# EAGLE design USB Snoop (EAGLE 6.5.0)
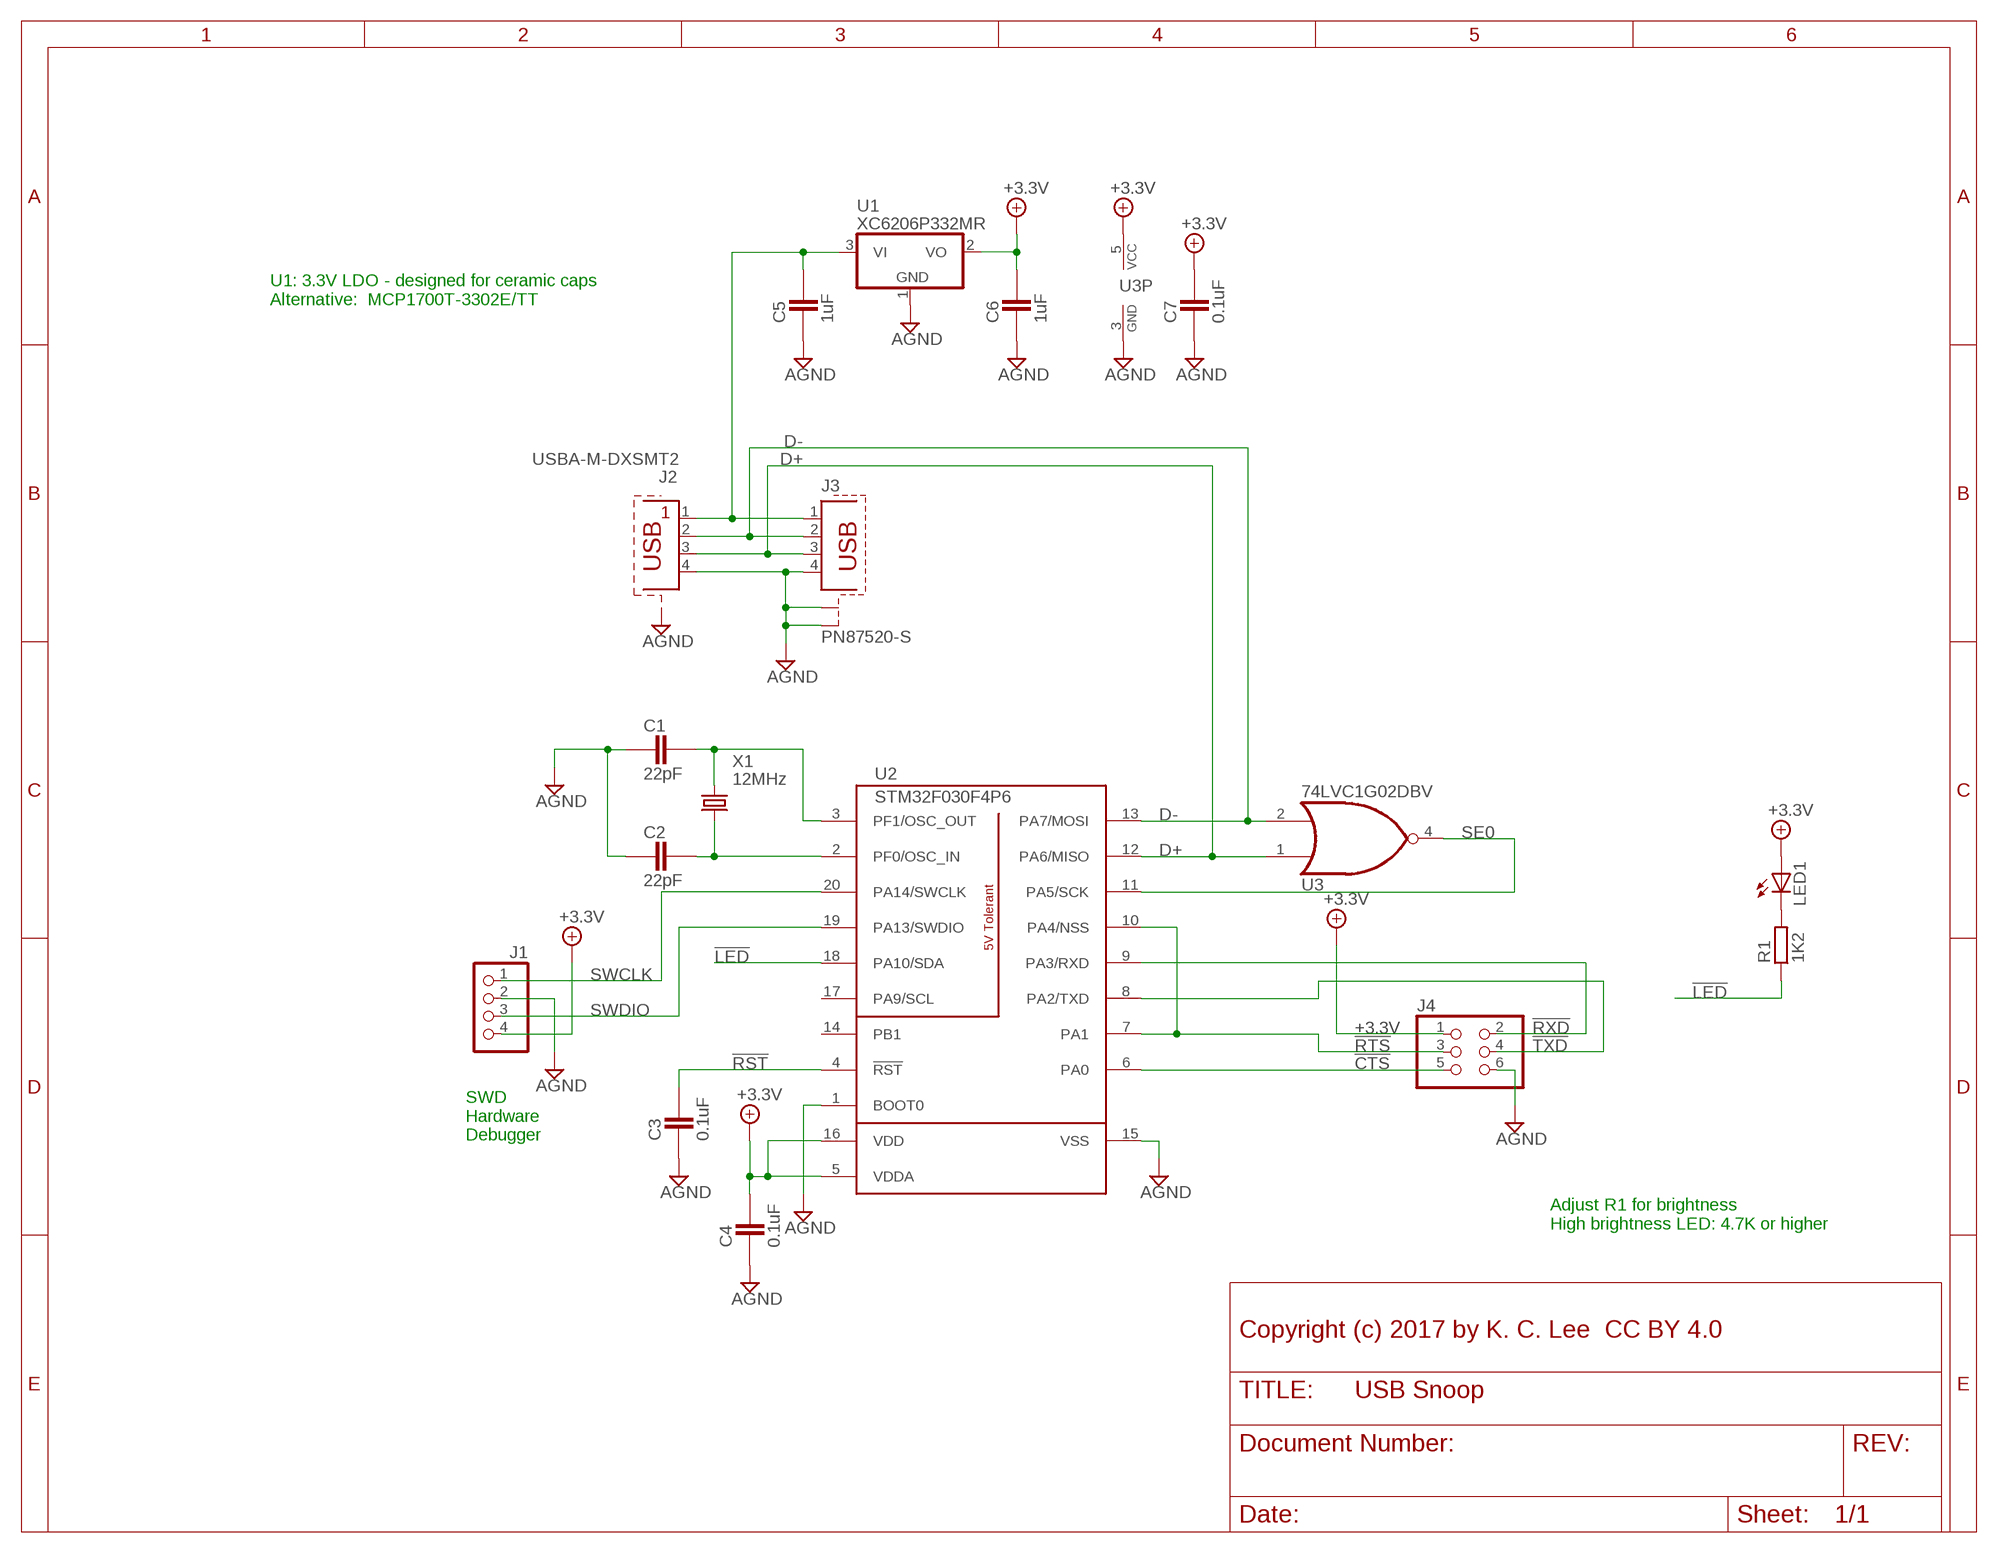
[diagram p0: schematic, sheet 1]

## Parts
C1  22pF  CAPACITOR_0603  [CAPC1608X92N]
C2  22pF  CAPACITOR_0603  [CAPC1608X92N]
C3  0.1uF  CAPACITOR_0603  [CAPC1608X92N]
C4  0.1uF  CAPACITOR_0603  [CAPC1608X92N]
C5  1uF  CAPACITOR_0603  [CAPC1608X92N]
C6  1uF  CAPACITOR_0603  [CAPC1608X92N]
C7  0.1uF  CAPACITOR_0603  [CAPC1608X92N]
J1  PINHD-1X4_2.54  [1X04]
J2  USBA-M-DXSMT2  [CHINESE_USB_M_SMT-2]
J3  PN87520-S  [PN87520-S]
J4  PINHD-2X3_2.00  [2X03M_TH]
LED1  LEDSML0603  [SML0603]
R1  1K2  RESISTOR_0603  [RESC1608X55N]
U1  XC6206P332MR  MCP1700/TT  [SOT95P280X135-3N]
U2  STM32F030F4P6  [TSSOP20]
U3  74LVC1G02DBV  [SOT23-5]
X1  12MHz  CRYSTALTC26H  [TC26H]

## Nets
!CTS: J4.5 U2.6(PA0)
!LED: R1.1 U2.18(PA10/SDA)
!RST: C3.2 U2.4(!RST)
!RTS: J4.3 U2.7(PA1) U2.10(PA4/NSS)
!RXD: J4.2 U2.9(PA3/RXD)
!TXD: J4.4 U2.8(PA2/TXD)
+3.3V: C4.2 C6.2 C7.2 J1.4 J4.1 LED1.A U1.2(VO) U2.5(VDDA) U2.16(VDD) U3.5(VCC)
AGND: C1.1 C2.1 C3.1 C4.1 C5.1 C6.1 C7.1 J1.2 J2.4 J2.S1 J2.S2(S1) J3.4 J3.S1 J3.S2 J4.6 U1.1(GND) U2.1(BOOT0) U2.15(VSS) U3.3(GND)
D+: J2.3 J3.3 U2.12(PA6/MISO) U3.1(I0)
D-: J2.2 J3.2 U2.13(PA7/MOSI) U3.2(I1)
N$1: C2.2 U2.2(PF0/OSC_IN) X1.2
N$2: LED1.C R1.2
N$41: C1.2 U2.3(PF1/OSC_OUT) X1.1
SE0: U2.11(PA5/SCK) U3.4(O)
SWCLK: J1.1 U2.20(PA14/SWCLK)
SWDIO: J1.3 U2.19(PA13/SWDIO)
VUSB: C5.2 J2.1 J3.1 U1.3(VI)
Unconnected: U2.14(PB1) U2.17(PA9/SCL)

## Notes on the sheet
- U1: 3.3V LDO - designed for ceramic caps
  Alternative:  MCP1700T-3302E/TT
- SWD 
  Hardware
  Debugger
- Adjust R1 for brightness
  High brightness LED: 4.7K or higher
- Copyright (c) 2017 by K. C. Lee  CC BY 4.0

## Library data of the parts
C1-C4 C7 = ipc-7351-capacitor:CAPACITOR_; PARTNO: *
C5 C6 = ipc-7351-capacitor:CAPACITOR_; PARTNO: STOCK: 1UF/10V 20% TDK
J1 = Misc Conn:PINHD-1X4: PIN HEADER; PARTNO: 1X04 HEADER 2.54MM
J2 = Misc Conn:USBA-M-DX: DX USB A Male PCB mounted connectors; PARTNO: *
J3 = con-berg:PN87520-S; OC_FARNELL: unknown; OC_NEWARK: unknown; PARTNO: *
J4 = Misc Conn:PINHD-2X3: PIN HEADER; PARTNO: *
LED1 = led:LED: LED OSRAM: - CHIPLED LG R971, LG N971, LY N971, LG Q971, LY Q971, LO R971, LY R971 LH N974, LH R974 LS Q976, LO Q976, LY Q976 LO Q996 - Hyper CHIPLED LW Q18S LB Q993, LB Q99A, LB R99A - SideLED LS A670, LO A670, LY A670, LG A670, LP A670 LB A673, LV A673, LT A673, LW A673 LH A674 LY A675 LS A676, LA A676, LO A676, LY A676, LW A676 LS A679, LY A679, LG A679 - Hyper Micro SIDELED® LS Y876, LA Y876, LO Y876, LY Y876 LT Y87S - SmartLED LW L88C, LW L88S LB L89C, LB L89S, LG L890 LS L89K, LO L89K, LY L89K LS L896, LA L896, LO L896, LY L896 - TOPLED LS T670, LO T670, LY T670, LG T670, LP T670 LSG T670, LSP T670, LSY T670, LOP T670, LYG T670 LG T671, LOG T671, LSG T671 LB T673, LV T673, LT T673, LW T673 LH T674 LS T676, LA T676, LO T676, LY T676, LB T676, LH T676, LSB T676, LW T676 LB T67C, LV T67C, LT T67C, LS T67K, LO T67K, LY T67K, LW E67C LS E67B, LA E67B, LO E67B, LY E67B, LB E67C, LV E67C, LT E67C LW T67C LS T679, LY T679, LG T679 LS T770, LO T770, LY T770, LG T770, LP T770 LB T773, LV T773, LT T773, LW T773 LH T774 LS E675, LA E675, LY E675, LS T675 LS T776, LA T776, LO T776, LY T776, LB T776 LHGB T686 LT T68C, LB T68C - Hyper Mini TOPLED® LB M676 - Mini TOPLED Santana® LG M470 LS M47K, LO M47K, LY M47K Source: http://www.osram.convergy.de LUXEON: - LUMILED® LXK2-PW12-R00, LXK2-PW12-S00, LXK2-PW14-U00, LXK2-PW14-V00 LXK2-PM12-R00, LXK2-PM12-S00, LXK2-PM14-U00 LXK2-PE12-Q00, LXK2-PE12-R00, LXK2-PE12-S00, LXK2-PE14-T00, LXK2-PE14-U00 LXK2-PB12-K00, LXK2-PB12-L00, LXK2-PB12-M00, LXK2-PB14-N00, LXK2-PB14-P00, LXK2-PB14-Q00 LXK2-PR12-L00, LXK2-PR12-M00, LXK2-PR14-Q00, LXK2-PR14-R00 LXK2-PD12-Q00, LXK2-PD12-R00, LXK2-PD12-S00 LXK2-PH12-R00, LXK2-PH12-S00 LXK2-PL12-P00, LXK2-PL12-Q00, LXK2-PL12-R00 Source: www.luxeon.com KINGBRIGHT: KA-3528ASYC Source: www.kingbright.com; PARTNO: *
R1 = ipc-7351-resistor:RESISTOR_; PARTNO: *
U1 = Misc Power:MCP1700; PARTNO: *
U2 = Misc Processor:STM32F030F4P6; PARTNO: *
U3 = 74xx-little-us:74*1G02: 2-input NOR gate; PARTNO: *
X1 = crystal:CRYSTAL: CRYSTAL; OC_FARNELL: unknown; OC_NEWARK: unknown; PARTNO: *

## Net classes
1 diff: width 0.003 mm, drill 0.006 mm, clearance 0.007 mm

## Board
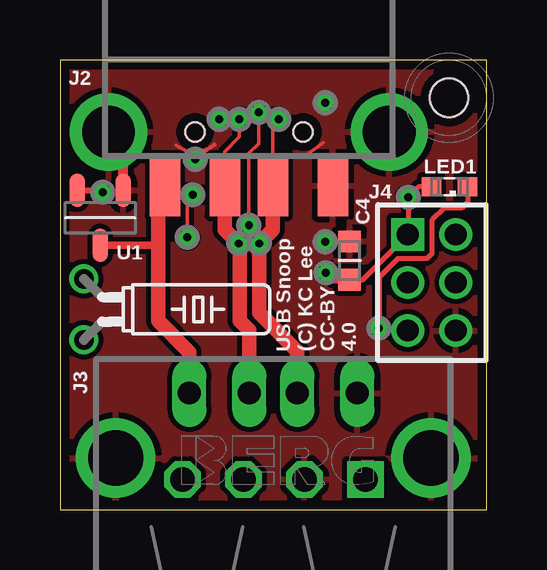
[diagram p1: board, top side]
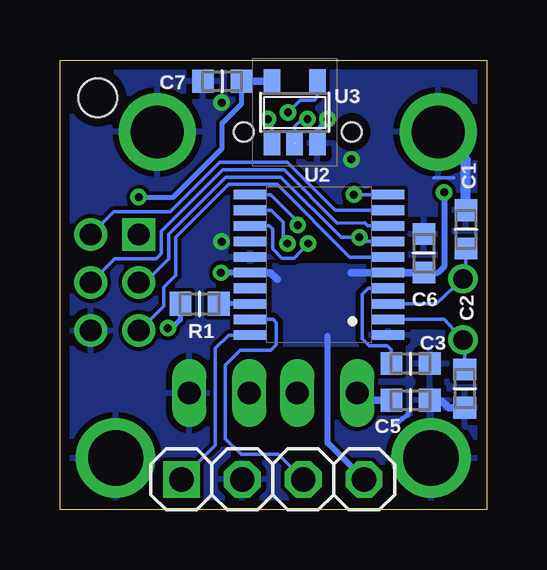
[diagram p2: board, bottom side, seen from below]

Size 17.78 x 18.75 mm. Coordinates in mm from the lower left corner, seen from the top.
Outline: 17.78,18.75 0,18.75 0,0 17.78,0 17.78,18.75
Copper layers (1*16): Top 0.0356mm / dielectric 1.5011mm / Bottom 0.0356mm
Design rules "oshpark-2layer-tented-vias": minimum track width 6mil, minimum drill 13mil, track to track 6mil, track to pad 6mil, pad to pad 6mil, via to via 6mil, smd to smd 6mil, copper to edge 15mil, drill to drill 6mil, minimum pad ring 7mil, minimum via ring 7mil, stop-mask expansion 4mil, vias tented up to drill 13mil, thermal gap 10mil
Holes 1.6 mm at 16.21,17.17
bRestrict: 1 lines

### Footprints (pad centres in the part's own frame; a part is rotated, then mirrored left to right if it is on the bottom)
CAPC1608X92N = smd 0.9 x 0.95: 1 -0.8,0; 2 0.8,0
1X04 = drill 1.016 square: 1 -3.81,0 | drill 1.016 octagon: 2 -1.27,0; 3 1.27,0; 4 3.81,0
CHINESE_USB_M_SMT-2 = smd 1.27 x 2.54: 1 3.5,2.242; 2 1,2.242; 3 -1,2.242; 4 -3.5,2.242 | drill 2.2 pad 2.794: S1 -5.85,0; S2 5.85,0 | hole 0.8: -2.25,0; 2.25,0
PN87520-S = drill 0.95 long: 1 -3.5,2.71; 2 -1,2.71; 3 1,2.71; 4 3.5,2.71 | drill 2.3 pad 2.9: S1 -6.57,0; S2 6.57,0
2X03M_TH = drill 0.914 square: 1 -2,-1 | drill 0.914: 2 -2,1; 3 0,-1; 4 0,1; 5 2,-1; 6 2,1
SML0603 = smd 0.8 x 0.8: A 0.75,0; C -0.75,0
RESC1608X55N = smd 0.9 x 1: 1 -0.8,0; 2 0.8,0
SOT95P280X135-3N = smd 1.4 x 0.65: 1 -1.15,0.95; 2 -1.15,-0.95; 3 1.15,0
TSSOP20 = smd 0.4 x 1.35: 1 -2.925,-2.875; 2 -2.275,-2.875; 3 -1.625,-2.875; 4 -0.975,-2.875; 5 -0.325,-2.875; 6 0.325,-2.875; 7 0.975,-2.875; 8 1.625,-2.875; 9 2.275,-2.875; 10 2.925,-2.875; 11 2.925,2.875; 12 2.275,2.875; 13 1.625,2.875; 14 0.975,2.875; 15 0.325,2.875; 16 -0.325,2.875; 17 -0.975,2.875; 18 -1.625,2.875; 19 -2.275,2.875; 20 -2.925,2.875
SOT23-5 = smd 0.69 x 0.99: 1 -0.95,-1.29; 2 0,-1.29; 3 0.95,-1.29; 4 0.95,1.3; 5 -0.95,1.3
TC26H = drill 0.813: 1 -1.27,0; 2 1.27,0

### Placement (x,y rotation side)
C1  0.86,11.68 270 bottom
C2  0.91,5.05 90 bottom
C3  3.17,6.1 180 bottom
C4  12.06,10.39 270 top
C5  3.17,4.57 180 bottom
C6  2.62,10.69 270 bottom
C7  11.02,17.86 0 bottom
J1  8.92,1.27 0 bottom
J2  7.87,15.75 180 top
J3  8.89,2.16 0 top
J4  15.49,9.47 270 top
LED1  16.23,13.46 180 top
R1  11.96,8.59 180 bottom
U1  1.68,12.17 270 top
U2  6.99,10.21 90 bottom
U3  8,16.56 0 bottom
X1  16MHz  [TC26H]  0.99,8.36 270 top

### Tracks (layer width: path | path; a pad name or v marks a point on that pad's centre or on a via)
!CTS
  Bottom 0.152: U2.6 5.71,10.54 8.74,13.56 10.74,13.56 12.95,11.35 12.95,9.78 13.46,9.27 13.46,8.48 J4.5
!LED
  Bottom 0.203: U2.18 R1.1
!RST
  Bottom 0.152: U2.4 4.94,9.24 5.18,8.99 5.18,7.14 4.9,6.83 4.14,6.83 3.98,6.67 C3.2
!RTS  (via drill 0.33)
  Top 0.152: v5.54,13.13 5.31,12.9 v5.31,11.35
  Bottom 0.152: U2.7 5.17,11.19 v5.31,11.35 6.07,11.35 8.59,13.87 10.87,13.87 13.26,11.48 13.26,10.46 14.25,9.47 J4.3 | U2.10 v5.53,13.14 v5.54,13.13
!RXD
  Bottom 0.152: U2.9 6.31,12.49 8.31,14.48 11.12,14.48 13.18,12.42 15.54,12.42 15.96,12.01 J4.2
!TXD
  Bottom 0.152: U2.8 4.95,11.84 5.08,11.96 6.22,11.94 8.43,14.17 11,14.17 13.56,11.61 13.56,10.67 13.77,10.46 15.49,10.46 J4.4
+3.3V  (via drill 0.33)
  Top 0.152: J4.1 14.5,11.48
  Top 0.203: J4.1 12.61,9.59 C4.2 | 14.5,11.48 v14.5,13.03 14.94,13.46 LED1.A
  Top 0.254: U1.2 1.68,13.32 v1.78,13.23
  Top 0.305: C4.2 11.37,9.59 v11.07,9.88
  Bottom 0.203: v14.5,13.03 13.06,13.03 11.02,15.06 11.02,16.1 10.22,16.9 C7.2
  Bottom 0.254: J1.4 6.63,2.79 6.63,7.24 | U2.16 10.97,9.89 v11.07,9.88 | C6.2 2.03,9.89 1.75,10.16 1.75,13.23 v1.78,13.23
  Bottom 0.305: U2.16 9.02,9.89 8.74,9.6 | 5.64,9.89 U2.5 C6.2 | C7.2 U3.5
  pour Bottom (isolate 0.203): 4.95,10.21 8.89,10.21 8.89,6.86 4.95,6.86
AGND  (via drill 0.33)
  Top 0.152: 4.85,15.19 4.98,15.11 5.41,14.88 5.87,14.88 | 10.21,14.76 10.97,15.29
  Top 0.178: 5.87,14.88 6.12,15.01 6.43,15.21
  Top 0.406: U1.1 2.63,15.15 J2.S2
  Bottom 0.152: 1.37,13.84 2.21,13.84
  Bottom 0.203: 3.23,4.17 3.3,3.94 3.66,3.68 3.81,3.68 | U3.3 7.05,15.81 6.63,16.23 6.63,16.31
  Bottom 0.254: 6.81,16.15 6.81,16.33
  Bottom 0.305: 1.87,4.53 1.59,4.25 C2.1 | 13.36,15.75 14.73,15.75
  Bottom 0.406: C1.1 0.86,14.59 J2.S2
  other vias: 6.63,16.28 11.05,11.18 11.05,16.97 5.64,14.61
  pour Top (isolate 0.203, rank 6): 0,18.67 17.78,18.8 17.78,0 0,0
  pour Bottom (isolate 0.152, rank 6): 17.78,18.8 0,18.8 0,0 17.78,0
D+  (via drill 0.33)
  Top 0.152: v9.12,16.28 8.87,16.04 J2.3
  Top 0.61: J3.3 9.89,6.62 8.31,8.2 v8.31,11.1 8.87,11.67 J2.3
  Bottom 0.152: U3.1 8.95,16.11 v9.12,16.28 | U2.12 8.98,12.49 8.48,11.99 8.48,11.28 v8.31,11.1
D-  (via drill 0.33)
  Top 0.152: v7.47,16.28 7.47,15.54 6.87,14.93 J2.2
  Top 0.61: J3.2 7.89,7.48 7.49,7.87 7.49,11.05 v7.44,11.1 6.87,11.67 J2.2
  Bottom 0.152: U2.13 9.07,11.84 8.91,11.68 8.91,10.87 8.53,10.49 8.03,10.49 v7.44,11.1 | U3.2 8,15.98 7.7,16.28 v7.47,16.28
N$1
  Bottom 0.152: C2.2 0.91,6.96 X1.2 1.76,7.94 U2.2
N$2  (via drill 0.33)
  Top 0.203: LED1.C 16.98,12.81 16.74,12.57 16,12.57 15.49,12.06 15.49,10.67 15.29,10.46 14.07,10.46 13.31,9.7 13.31,7.59 v13.28,7.57
  Bottom 0.203: v13.28,7.57 13.11,7.57 12.76,7.91 R1.2
N$41
  Bottom 0.152: U2.3 2.11,8.59 X1.1 0.86,9.75 C1.2
SE0  (via drill 0.33)
  Top 0.152: v8.28,16.56 8.28,15.27 7.87,14.86 v7.87,11.86
  Bottom 0.152: v7.87,11.86 7.87,12.01 8.99,13.13 U2.11 | U3.4 7.05,17.21 7.19,17.07 7.77,17.07 v8.28,16.56
SWCLK
  Bottom 0.152: U2.20 10.75,7.29 11.3,6.73 11.3,2.69 J1.1
SWDIO
  Bottom 0.152: U2.19 8.9,7.94 8.76,7.8 8.76,6.88 8.99,6.66 10.26,6.66 10.9,6.02 10.9,2.97 10.24,2.31 8.69,2.31 J1.3
VUSB
  Top 0.305: U1.3 4,11.02 4.09,10.92
  Top 0.61: J3.1 5.39,6.57 4.09,7.87 4.09,10.92 4.09,13.22 J2.1
  Bottom 0.305: C5.2 5.09,4.57 J3.1

### Text on the board
tPlace: USB Snoop / (C) KC Lee / CC-BY / 4.0